# Altium schematic sheet [07] - DOC REVISION HISTORY.SchDoc
size A3; DocumentNumber: 3; SheetNumber: 3; SheetTotal: 4; NameAuthor: Angle Vu
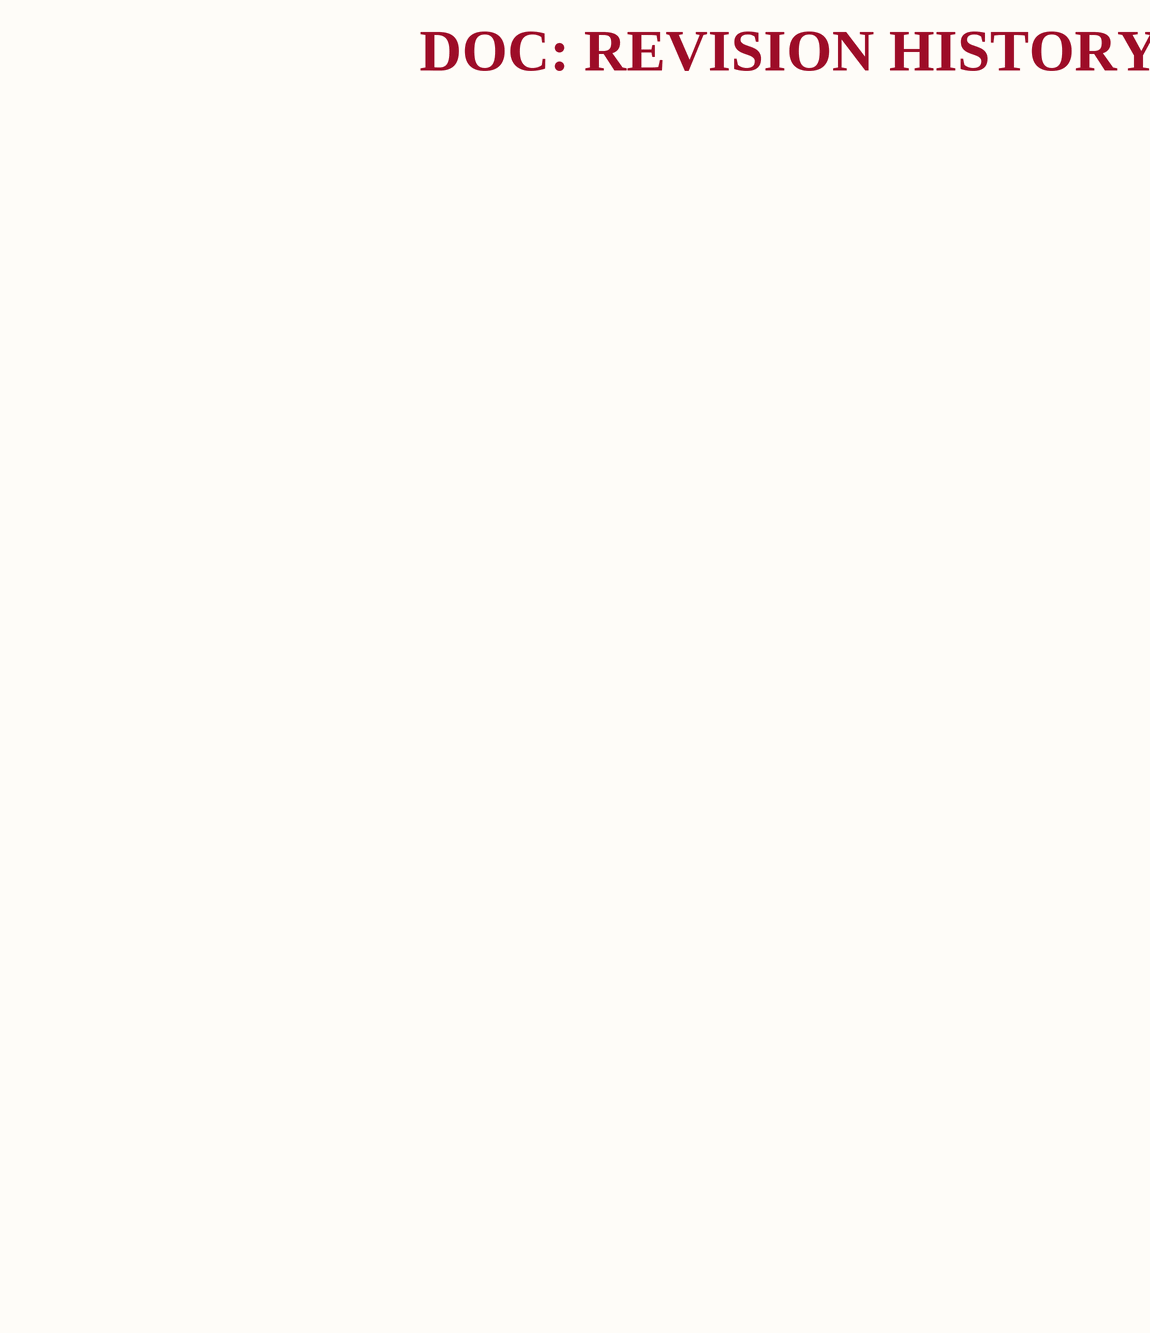
[diagram p0: [07] - DOC REVISION HISTORY.SchDoc]

## Notes on the sheet
- DOC: REVISION HISTORY
- CLOCKS (CPU & PCIE)
- Designed By
- Checked By
- Company:
- Size:
- A3
- Address:
- Sheet:
- /